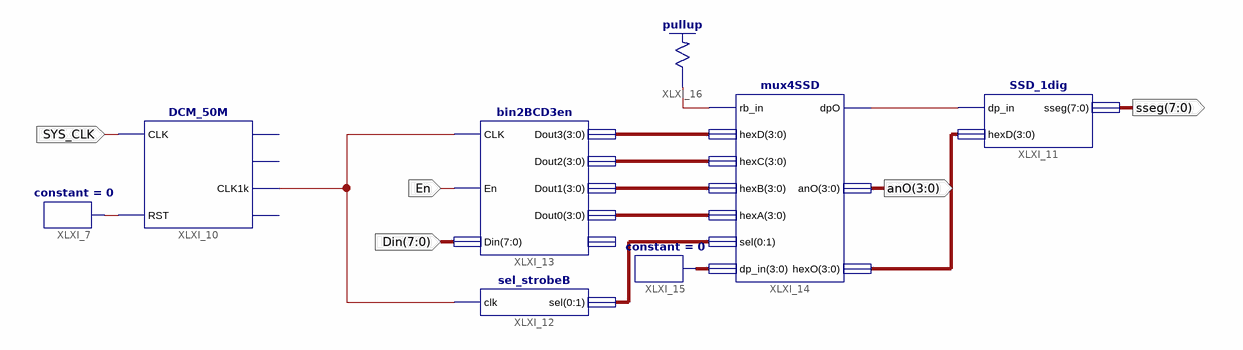
[diagram p0: schematic sheet 1]
// Xilinx ISE schematic seven_seg.sch (spartan3e) as structural Verilog: 8 symbols, 5 ports
module seven_seg (
  input  SYS_CLK,
  input  En,
  input  [7:0] Din,
  output [3:0] anO,
  output [7:0] sseg
);

  wire XLXN_7, XLXN_37, XLXN_39, XLXN_42;
  wire [1:0] XLXN_34;
  wire [3:0] XLXN_14, XLXN_16, XLXN_17, XLXN_18, XLXN_36, XLXN_41;

  constant #(.CValue("0")) XLXI_7 (.O(XLXN_7));
  DCM_50M XLXI_10 (.CLK(SYS_CLK), .RST(XLXN_7), .CLK1k(XLXN_39));  // open: CLK1M, CLK10k, CLK1
  SSD_1dig XLXI_11 (.dp_in(XLXN_37), .hexD(XLXN_36), .sseg(sseg));
  sel_strobeB XLXI_12 (.clk(XLXN_39), .sel({XLXN_34[0], XLXN_34[1]}));
  bin2BCD3en XLXI_13 (
    .CLK(XLXN_39), .En(En), .Din(Din), .Dout3(XLXN_14), .Dout2(XLXN_18), .Dout1(XLXN_16), .Dout0(XLXN_17));  // open: RBout
  constant #(.CValue("0")) XLXI_15 (.O(XLXN_41));
  \pullup  XLXI_16 (.O(XLXN_42));
  mux4SSD XLXI_14 (
    .rb_in(XLXN_42), .hexD(XLXN_14), .hexC(XLXN_18), .hexB(XLXN_16), .hexA(XLXN_17),
    .sel({XLXN_34[0], XLXN_34[1]}), .dp_in(XLXN_41), .dpO(XLXN_37), .anO(anO), .hexO(XLXN_36));
endmodule
